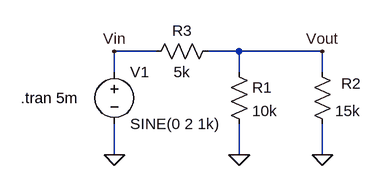
[diagram p0: schematic sinewave_volt_div.asc]
sinewave_volt_div.asc, the LTspice schematic file:
Version 4
SHEET 1 880 680
WIRE 112 48 48 48
WIRE 240 48 192 48
WIRE 368 48 240 48
WIRE 48 80 48 48
WIRE 240 80 240 48
WIRE 368 80 368 48
WIRE 48 208 48 160
WIRE 240 208 240 160
WIRE 368 208 368 160
FLAG 48 208 0
FLAG 240 208 0
FLAG 368 208 0
FLAG 368 48 Vout
FLAG 48 48 Vin
SYMBOL res 224 64 R0
SYMATTR InstName R1
SYMATTR Value 10k
SYMBOL res 352 64 R0
WINDOW 0 45 34 Left 2
SYMATTR InstName R2
SYMATTR Value 15k
SYMBOL res 208 32 R90
WINDOW 0 0 56 VBottom 2
WINDOW 3 32 56 VTop 2
SYMATTR InstName R3
SYMATTR Value 5k
SYMBOL voltage 48 64 R0
WINDOW 123 0 0 Left 0
WINDOW 39 0 0 Left 0
SYMATTR InstName V1
SYMATTR Value SINE(0 2 1k)
TEXT -96 120 Left 2 !.tran 5m

The netlist it stands for:
* sinewave_volt_div.asc
R1 Vout 0 10k
R2 Vout 0 15k
R3 Vout Vin 5k
V1 Vin 0 SINE(0 2 1k)
.tran 5m
.backanno
.end